# EAGLE schematic motor_controller (EAGLE 7.6.0)
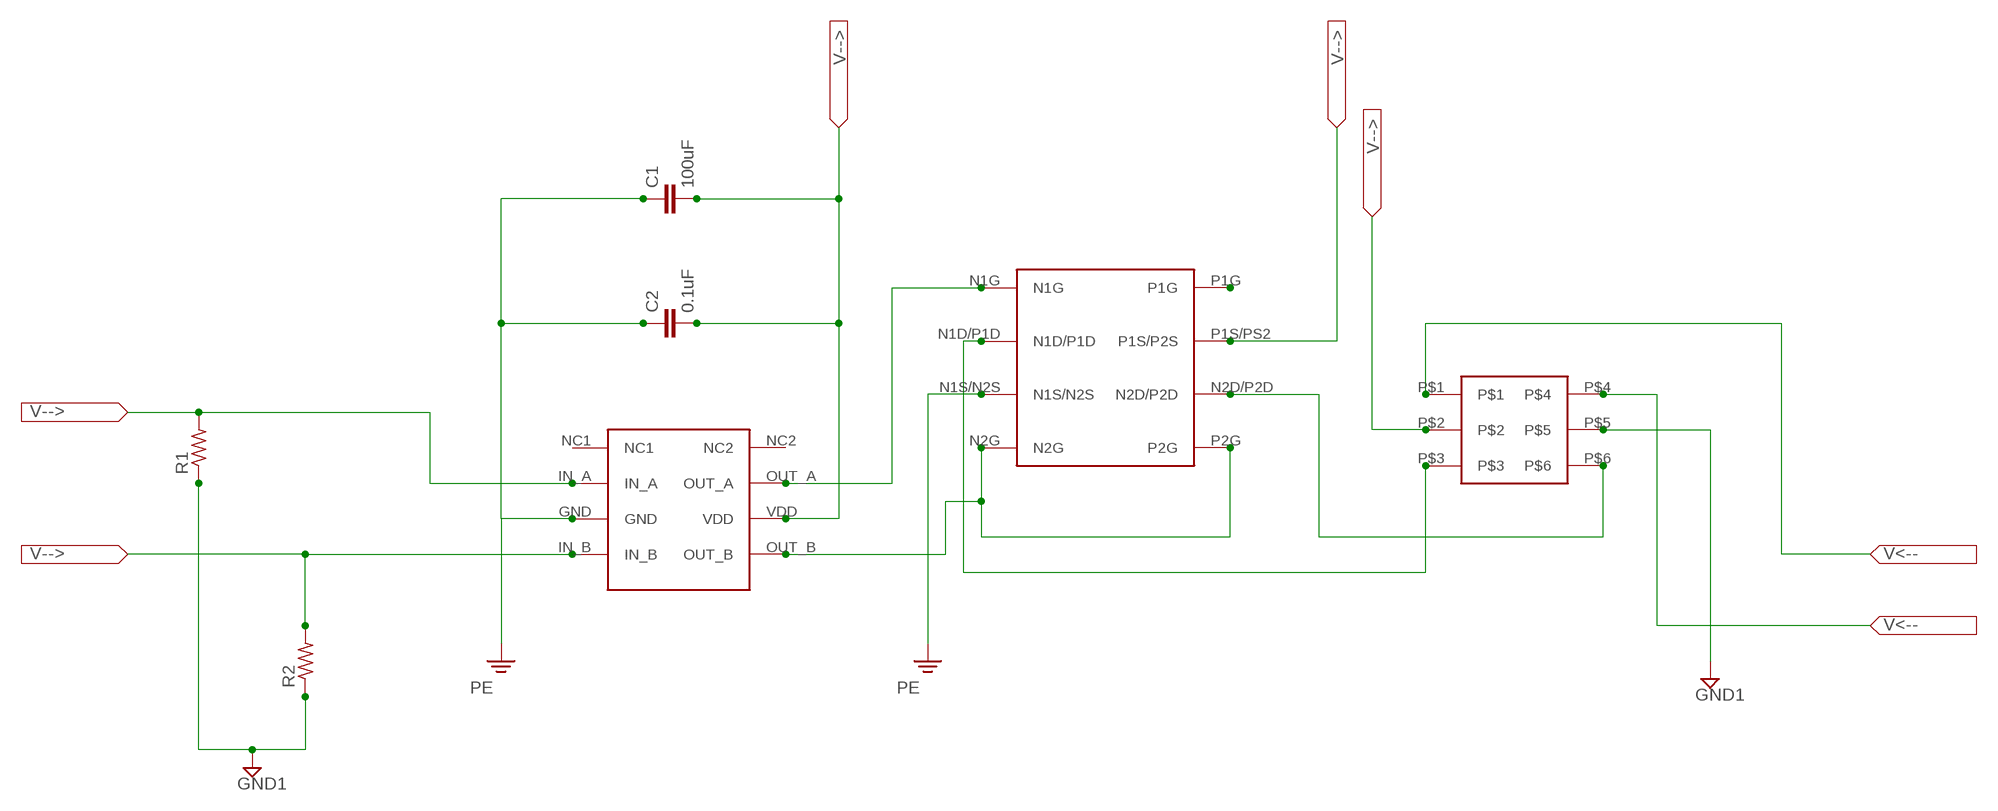
[diagram p0: schematic, sheet 1]

## Parts
C1  100uF  C-EUC1206  [C1206]
C2  0.1uF  C-EUC1206  [C1206]
R1  R-US_M1206  [M1206]
R2  R-US_M1206  [M1206]
U$1  TC44278MSOP  [TC44278MSOP]
U$2  H-BRIDGE  [H-BRIDGE]
U$3  2X3HEADER  [2X3HEADER]

## Nets
GND1: R1.1 R2.1 U$3.P$5
N$1: R1.2 U$1.IN_A
N$2: U$3.P$1
N$3: R2.2 U$1.IN_B
N$5: U$2.N1D/P1D
N$6: U$3.P$2
N$7: U$3.P$3
N$8: C1.2 C2.2 U$1.VDD
N$9: U$2.P1G
N$10: U$2.P1S/PS2(P1S/P2S)
N$11: U$3.P$4
N$12: U$1.OUT_A U$2.N1G
N$13: U$2.N2D/P2D U$3.P$6
N$14: U$1.OUT_B U$2.N2G U$2.P2G
PE: C1.1 C2.1 U$1.GND U$2.N1S/N2S
Unconnected: U$1.NC1 U$1.NC2

## Library data of the parts
C1 C2 = resistor:C-EU: CAPACITOR, European symbol
R1 R2 = resistor:R-US_: RESISTOR, American symbol
U$1 = MMmosfet:TC44278MSOP
U$2 = MMHbridge:H-BRIDGE
U$3 = MM2x3Header:2X3HEADER